# Altium schematic sheet SDC23.SchDoc
size A4; SheetNumber: 1; SheetTotal: 1; SPICEModelCacheTWXAGPOD: <root> / <DocumentId>TWXAGPOD</DocumentId> / <CacheFrame Number="0"> / <Model Name="1n4007" Kind="MDL"> / <Text>*1N4007 MCE 8-16-95 / *1000V 1A Si GenPurpose Diode pkg:DIODE0.4 1,2 / .MODEL 1N4007 D(IS=2.55E-9 RS=0.042 N=1.75 TT=5.76E-6 CJO=1.85E-11 / + VJ=0.75 M=0.333 BV=1000 IBV=9.86E-5 )</Text> / </Model> / </CacheFrame> / </root>
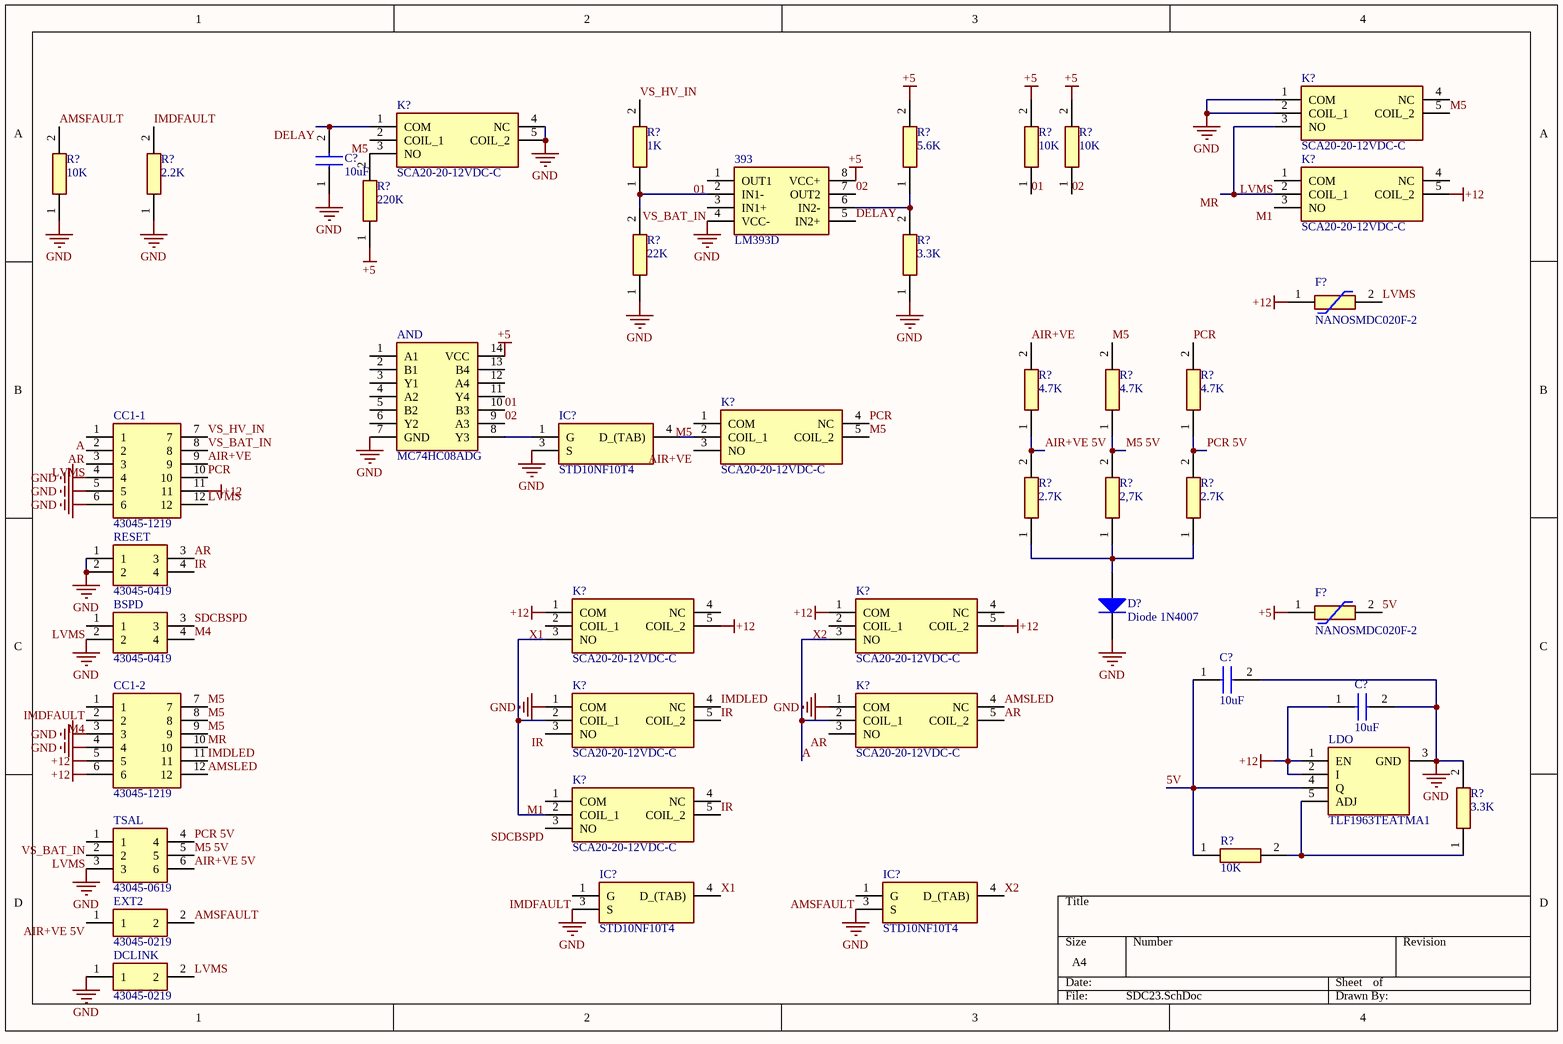
[diagram p0: SDC23.SchDoc]

## Parts
(Parts that share a designator on the sheet are numbered #1, #2 ... from top to bottom, then left to right.)
393  LM393D  [SOIC127P600X175-8N]
AND  MC74HC08ADG  [SOIC127P600X175-14N]
BSPD  43045-0419  [43045-04YY_181920]
C?#1  10uF  [CAPC3225X145N]
C?#2  10uF  [CAPC3225X145N]
C?#3  10uF  [CAPC3225X145N]
CC1-1  43045-1219  [43045-12YY_181920]
CC1-2  43045-1219  [43045-12YY_181920]
D?  Diode 1N4007  [DO-41]
DCLINK  43045-0219  [43045-02YY_181920]
EXT2  43045-0219  [43045-02YY_181920]
F?#1  NANOSMDC020F-2  [NANOSMDC016F2]
F?#2  NANOSMDC020F-2  [NANOSMDC016F2]
IC?#1  STD10NF10T4  [TO228P972X240-3N]
IC?#2  STD10NF10T4  [TO228P972X240-3N]
IC?#3  STD10NF10T4  [TO228P972X240-3N]
K?#1  SCA20-20-12VDC-C  [SCA202012VDCC]
K?#2  SCA20-20-12VDC-C  [SCA202012VDCC]
K?#3  SCA20-20-12VDC-C  [SCA202012VDCC]
K?#4  SCA20-20-12VDC-C  [SCA202012VDCC]
K?#5  SCA20-20-12VDC-C  [SCA202012VDCC]
K?#6  SCA20-20-12VDC-C  [SCA202012VDCC]
K?#7  SCA20-20-12VDC-C  [SCA202012VDCC]
K?#8  SCA20-20-12VDC-C  [SCA202012VDCC]
K?#9  SCA20-20-12VDC-C  [SCA202012VDCC]
LDO  TLF1963TEATMA1  [TLF1963TEATMA1]
R?#1  1K  [RESC3126X60N]
R?#2  5.6K  [RESC3126X60N]
R?#3  10K  [RESC3126X60N]
R?#4  10K  [RESC3126X60N]
R?#5  10K  [RESC3126X60N]
R?#6  2.2K  [RESC3126X60N]
R?#7  220K  [RESC3126X60N]
R?#8  22K  [RESC3126X60N]
R?#9  3.3K  [RESC3126X60N]
R?#10  4.7K  [RESC3126X60N]
R?#11  4.7K  [RESC3126X60N]
R?#12  4.7K  [RESC3126X60N]
R?#13  2.7K  [RESC3126X60N]
R?#14  2,7K  [RESC3126X60N]
R?#15  2.7K  [RESC3126X60N]
R?#16  10K  [RESC3126X60N]
R?#17  3.3K  [RESC3126X60N]
RESET  43045-0419  [43045-04YY_181920]
TSAL  43045-0619  [43045-06YY_181920]

## Nets
+5: 393.8(VCC+) AND.14(VCC) F?#2.1 R?#2.2 R?#3.2 R?#4.2 R?#7.1
+12: C?#3.1 CC1-1.11 CC1-2.5 CC1-2.6 F?#1.1 K?#3.5(COIL_2) K?#5.1(COM) K?#5.5(COIL_2) K?#6.1(COM) K?#6.5(COIL_2) LDO.1(EN) LDO.2(I)
GND: 393.4(VCC-) AND.7(GND) BSPD.2 C?#1.1 C?#2.2 C?#3.2 CC1-1.4 CC1-1.5 CC1-1.6 CC1-2.3 CC1-2.4 D?.2(K) DCLINK.1 IC?#1.3(S) IC?#2.3(S) IC?#3.3(S) K?#1.1(COM) K?#1.2(COIL_1) K?#2.4(NC) K?#2.5(COIL_2) K?#7.1(COM) K?#8.1(COM) LDO.3(GND) R?#5.1 R?#6.1 R?#8.1 R?#9.1 R?#17.2 RESET.1 RESET.2 TSAL.3
01: 393.1(OUT1) AND.10(B3) R?#3.1
02: 393.7(OUT2) AND.9(A3) R?#4.1
5V: C?#2.1 F?#2.2 LDO.4(Q) R?#16.1
A: CC1-1.1 K?#6.3(NO) K?#8.2(COIL_1)
AIR+VE: CC1-1.9 K?#4.3(NO) R?#10.2
AIR+VE 5V: EXT2.1 R?#10.1 R?#13.2 TSAL.6
AMSFAULT: EXT2.2 IC?#3.1(G) R?#5.2
AMSLED: CC1-2.12 K?#8.4(NC)
AR: CC1-1.2 K?#8.3(NO) K?#8.5(COIL_2) RESET.3
DELAY: 393.5(IN2+) C?#1.2 K?#2.1(COM)
IMDFAULT: CC1-2.1 IC?#2.1(G) R?#6.2
IMDLED: CC1-2.11 K?#7.4(NC)
IR: K?#7.3(NO) K?#7.5(COIL_2) K?#9.5(COIL_2) RESET.4
LVMS: BSPD.1 CC1-1.3 CC1-1.12 DCLINK.2 F?#1.2 K?#3.1(COM) TSAL.2
M1: K?#3.3(NO) K?#9.1(COM)
M4: BSPD.4 CC1-2.2
M5: CC1-2.7 CC1-2.8 CC1-2.9 K?#1.5(COIL_2) K?#2.2(COIL_1) K?#4.1(COM) K?#4.5(COIL_2) R?#11.2
M5 5V: R?#11.1 R?#14.2 TSAL.5
MR: CC1-2.10 K?#1.3(NO) K?#3.2(COIL_1)
PCR: CC1-1.10 K?#4.4(NC) R?#12.2
PCR 5V: R?#12.1 R?#15.2 TSAL.4
SDCBSPD: BSPD.3 K?#9.3(NO)
VS_BAT_IN: 393.3(IN1+) CC1-1.8 TSAL.1
VS_HV_IN: CC1-1.7 R?#1.2
X1: IC?#2.4(D_(TAB)) K?#5.2(COIL_1)
X2: IC?#3.4(D_(TAB)) K?#6.2(COIL_1)
Net393_2: 393.2(IN1-) R?#1.1 R?#8.2
Net393_6: 393.6(IN2-) R?#2.1 R?#9.2
NetAND_8: AND.8(Y3) IC?#1.1(G)
NetD?_1: D?.1(A) R?#13.1 R?#14.1 R?#15.1
NetIC?#1_4: IC?#1.4(D_(TAB)) K?#4.2(COIL_1)
NetK?#2_3: K?#2.3(NO) R?#7.2
NetK?#5_3: K?#5.3(NO) K?#7.2(COIL_1) K?#9.2(COIL_1)
NetLDO_5: LDO.5(ADJ) R?#16.2 R?#17.1

Not connected (* = marked no-connect by the designer): AND 1(A1) 2(B1) 3(Y1) 4(A2) 5(B2) 6(Y2) 11(Y4) 12(A4) 13(B4); K?#1 4(NC); K?#3 4(NC); K?#5 4(NC); K?#6 4(NC); K?#9 4(NC)

## Library data of the parts
393 = LM393D: Integrated Circuit; Manufacturer_Name: STMicroelectronics; Datasheet Link: http://www.st.com/st-web-ui/static/active/en/resource/technical/document/datasheet/CD00000465.pdf; Height: 1.75mm; Manufacturer_Part_Number: LM393D; Mouser Part Number: 511-LM393D; Mouser Price/Stock: https://www.mouser.co.uk/ProductDetail/STMicroelectronics/LM393D?qs=htKRmzjvioSpfPyLiLnV1A%3D%3D; Arrow Part Number: LM393D; Arrow Price/Stock: https://www.arrow.com/en/products/lm393d/stmicroelectronics?region=europe
AND = MC74HC08ADG: Integrated Circuit; Manufacturer_Name: ON Semiconductor; Datasheet Link: http://www.onsemi.com/pub/Collateral/MC74HC08A-D.PDF; Height: 1.75mm; Manufacturer_Part_Number: MC74HC08ADG; Mouser Part Number: 863-MC74HC08ADG; Mouser Price/Stock: https://www.mouser.co.uk/ProductDetail/ON-Semiconductor/MC74HC08ADG?qs=qg33o%252B8vzFqW0duu5mW%2FLA%3D%3D; Arrow Part Number: MC74HC08ADG; Arrow Price/Stock: https://www.arrow.com/en/products/mc74hc08adg/on-semiconductor
BSPD RESET = 43045-0419: Connector; Manufacturer_Name: Molex; Datasheet Link: https://www.molex.com/pdm_docs/sd/430450218_sd.pdf; Height: 9.91mm; Manufacturer_Part_Number: 43045-0419; Mouser Part Number: 538-43045-0419; Mouser Price/Stock: https://www.mouser.co.uk/ProductDetail/Molex/43045-0419?qs=UeCeOHRHQebVNIQyI9VWWg%3D%3D
C?#1-C?#3 = CC1210KKX7R8BB105: Capacitor; Manufacturer_Name: YAGEO (PHYCOMP); Datasheet Link: https://datasheet.datasheetarchive.com/originals/distributors/Datasheets_SAMA/d9f127a4875522309d99aa7dec79633c.pdf; Height: 1.45mm; Manufacturer_Part_Number: CC1210KKX7R8BB105; Mouser Part Number: 603-CC121KKX7R8BB105; Mouser Price/Stock: https://www.mouser.com/Search/Refine.aspx?Keyword=603-CC121KKX7R8BB105; Arrow Part Number: CC1210KKX7R8BB105; Arrow Price/Stock: https://www.arrow.com/en/products/cc1210kkx7r8bb105/yageo?region=nac
CC1-1 CC1-2 = 43045-1219: Connector; Manufacturer_Name: Molex; Datasheet Link: https://www.molex.com/pdm_docs/sd/430450218_sd.pdf; Height: 9.91mm; Manufacturer_Part_Number: 43045-1219; Mouser Part Number: 538-43045-1219; Mouser Price/Stock: https://www.mouser.co.uk/ProductDetail/Molex/43045-1219?qs=359VwiUTsp3iCU2NVYxNVg%3D%3D
D? = Diode 1N4007: 1 Amp General Purpose Rectifier; Published: 8-Jun-2000; LatestRevisionDate: 17-Jul-2002; LatestRevisionNote: Re-released for DXP Platform.; DatasheetVersion: 1998; PackageVersion: Aug-1999; PackageReference: DO-41; Publisher: Altium Limited; PackageDescription: Diode, Axial; Body 5.2 x 2.7 mm (LxDia. max), Lead Dia. 0.86 mm (max); Code_JEDEC: DO-204-AL; ComponentLink1Description: Manufacturer Link; ComponentLink1URL: http://www.fairchildsemi.com/; ComponentLink2Description: Datasheet; ComponentLink2URL: http://www.fairchildsemi.com/ds/1N%2F1N4001.pdf
DCLINK EXT2 = 43045-0219: Connector; Manufacturer_Name: Molex; Datasheet Link: https://www.molex.com/pdm_docs/sd/430450218_sd.pdf; Height: 9.91mm; Manufacturer_Part_Number: 43045-0219; Mouser Part Number: 538-43045-0219; Mouser Price/Stock: https://www.mouser.co.uk/ProductDetail/Molex/43045-0219?qs=4XSMV6Twtb0nwQMN7xrpYA%3D%3D; Arrow Part Number: 43045-0219; Arrow Price/Stock: https://www.arrow.com/en/products/43045-0219/molex?region=nac
F?#1 F?#2 = NANOSMDC020F-2: Resettable Fuse; Manufacturer_Name: LITTELFUSE; Datasheet Link: https://www.littelfuse.com/~/media/electronics/datasheets/resettable_ptcs/littelfuse_ptc_nanosmdc_datasheet.pdf.pdf; Height: 1mm; Manufacturer_Part_Number: NANOSMDC020F-2; Mouser Part Number: 650-NANOSMDC020F-2; Mouser Price/Stock: https://www.mouser.co.uk/ProductDetail/Littelfuse/NANOSMDC020F-2?qs=iK0evp%252BCRRU6agwMt7HYjg%3D%3D; Arrow Part Number: NANOSMDC020F-2; Arrow Price/Stock: https://www.arrow.com/en/products/nanosmdc020f-2/littelfuse
IC?#1-IC?#3 = STD10NF10T4: Integrated Circuit; Manufacturer_Name: STMicroelectronics; Datasheet Link: http://www.st.com/web/en/resource/technical/document/datasheet/CD00002133.pdf; Height: 2.4mm; Manufacturer_Part_Number: STD10NF10T4; Mouser Part Number: 511-STD10NF10; Mouser Price/Stock: https://www.mouser.co.uk/ProductDetail/STMicroelectronics/STD10NF10T4?qs=El1T93pd01%2FBh%252BX9NfIsIQ%3D%3D; Arrow Part Number: STD10NF10T4; Arrow Price/Stock: https://www.arrow.com/en/products/std10nf10t4/stmicroelectronics
K?#1-K?#9 = SCA20-20-12VDC-C: Relay or Contactor; Manufacturer_Name: LEONE; Datasheet Link: https://www.kuraelectronics.com/new-pdf/SCA%2020.pdf; Height: 13.7mm; Manufacturer_Part_Number: SCA20-20-12VDC-C
LDO = TLF1963TEATMA1: Integrated Circuit; Manufacturer_Name: Infineon; Datasheet Link: https://www.infineon.com/dgdl/Infineon-TLF1963-DS-v01_00-EN.pdf?fileId=5546d46258fc0bc1015969d2981941e0; Height: 2.35mm; Manufacturer_Part_Number: TLF1963TEATMA1; Mouser Part Number: 726-TLF1963TEATMA1; Mouser Price/Stock: https://www.mouser.co.uk/ProductDetail/Infineon-Technologies/TLF1963TEATMA1?qs=SiyfpgnvCZluIGE%2FbZiglw%3D%3D; Arrow Part Number: TLF1963TEATMA1; Arrow Price/Stock: https://www.arrow.com/en/products/tlf1963teatma1/infineon-technologies-ag?region=nac
R?#1-R?#17 = RC1210JR-070RL: Resistor; Manufacturer_Name: YAGEO (PHYCOMP); Datasheet Link: https://datasheet.datasheetarchive.com/originals/distributors/Datasheets_SAMA/902f9e387b938f871d31120f5fc1d65e.pdf; Height: 0.6mm; Manufacturer_Part_Number: RC1210JR-070RL; Mouser Part Number: 603-RC1210JR-070RL; Mouser Price/Stock: https://www.mouser.co.uk/ProductDetail/YAGEO/RC1210JR-070RL?qs=eVUp2xEqV%2FtpfK61W3Q4CQ%3D%3D; Arrow Part Number: RC1210JR-070RL; Arrow Price/Stock: https://www.arrow.com/en/products/rc1210jr-070rl/yageo
TSAL = 43045-0619: Connector; Manufacturer_Name: Molex; Datasheet Link: https://www.molex.com/pdm_docs/sd/430450218_sd.pdf; Height: 9.91mm; Manufacturer_Part_Number: 43045-0619; Mouser Part Number: 538-43045-0619; Mouser Price/Stock: https://www.mouser.co.uk/ProductDetail/Molex/43045-0619?qs=KC2ywxza1kr7EVu5MuTw7g%3D%3D; Arrow Part Number: 43045-0619; Arrow Price/Stock: https://www.arrow.com/en/products/43045-0619/molex